# EAGLE design TaggerBits0.1 (EAGLE 7.3.0)
sdasdsadasdsads
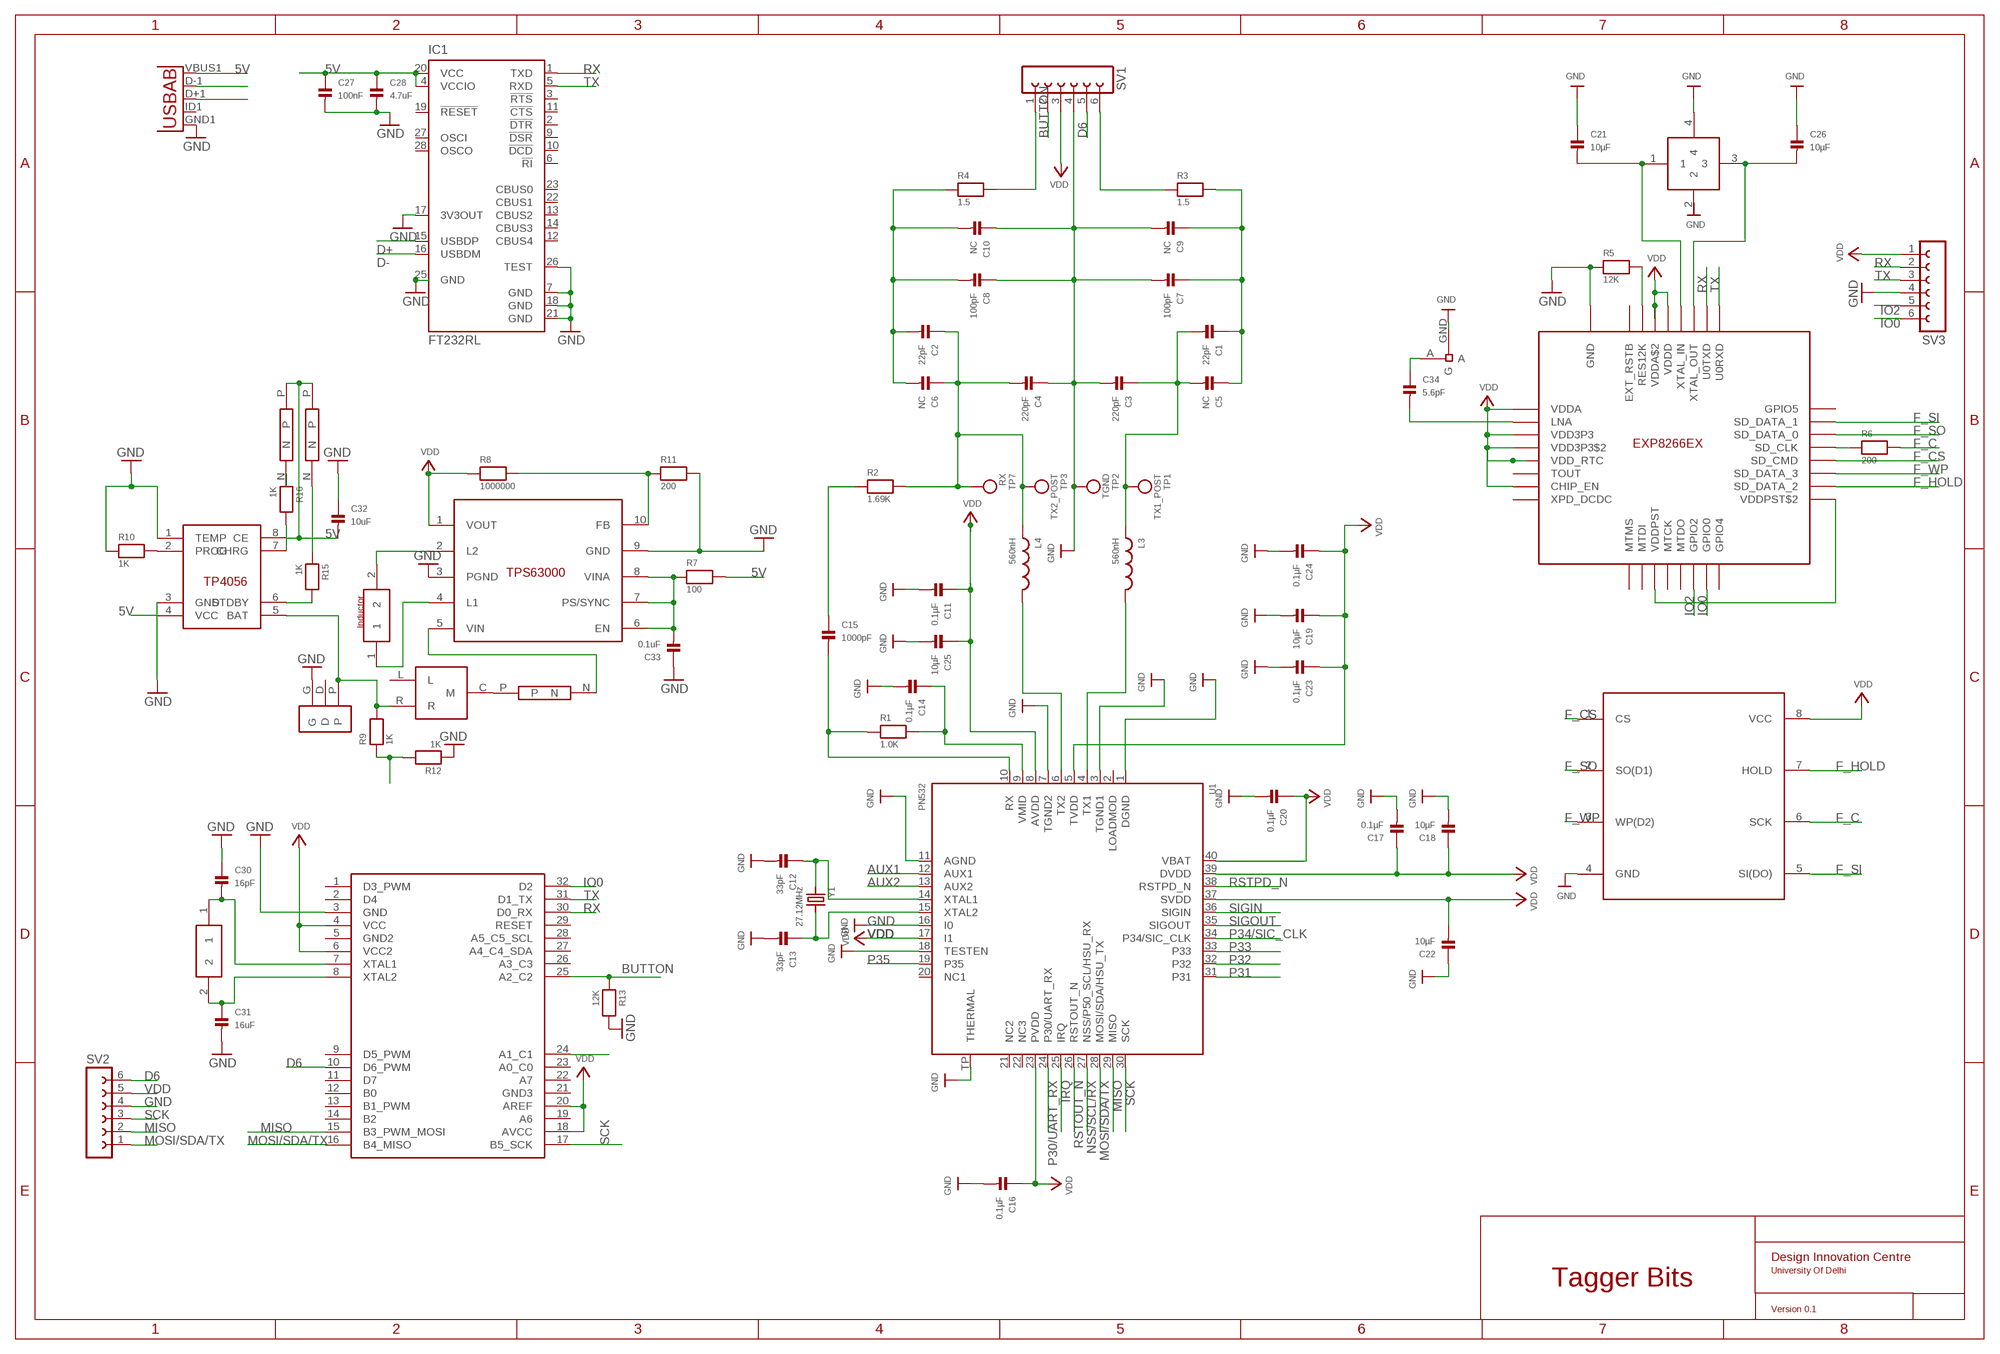
[diagram p0: schematic, sheet 1]

## Parts
C1  22pF  CAP_CERAMIC0805  [0805]
C2  22pF  CAP_CERAMIC0805  [0805]
C3  220pF  CAP_CERAMIC0805  [0805]
C4  220pF  CAP_CERAMIC0805  [0805]
C5  NC  CAP_CERAMIC0805  [0805]
C6  NC  CAP_CERAMIC0805  [0805]
C7  100pF  CAP_CERAMIC0805  [0805]
C8  100pF  CAP_CERAMIC0805  [0805]
C9  NC  CAP_CERAMIC0805  [0805]
C10  NC  CAP_CERAMIC0805  [0805]
C11  0.1µF  CAP_CERAMIC0805  [0805]
C12  33pF  CAP_CERAMIC0805  [0805]
C13  33pF  CAP_CERAMIC0805  [0805]
C14  0.1µF  CAP_CERAMIC0805  [0805]
C15  1000pF  CAP_CERAMIC0805  [0805]
C16  0.1µF  CAP_CERAMIC0805  [0805]
C17  0.1µF  CAP_CERAMIC0805  [0805]
C18  10µF  CAP_CERAMIC0805  [0805]
C19  10µF  CAP_CERAMIC0805  [0805]
C20  0.1µF  CAP_CERAMIC0805  [0805]
C21  10µF  CAP_CERAMIC0805  [0805]
C22  10µF  CAP_CERAMIC0805  [0805]
C23  0.1µF  CAP_CERAMIC0805  [0805]
C24  0.1µF  CAP_CERAMIC0805  [0805]
C25  10µF  CAP_CERAMIC0805  [0805]
C26  10µF  CAP_CERAMIC0805  [0805]
C27  100nF  CAP_CERAMIC0805  [0805]
C28  4.7uF  CAP_CERAMIC0805  [0805]
C30  16pF  CAP_CERAMIC0805  [0805]
C31  16uF  CAP_CERAMIC0805  [0805]
C32  10uF  CAP_CERAMIC0805  [0805]
C33  0.1uF  CAP_CERAMIC0805  [0805]
C34  5.6pF  CAP_CERAMIC0805  [0805]
GREEN  LED(805)  [LED(805)]
IC1  FT232RL  [SSOP28]
L3  560nH  INDUCTOR0805  [0805]
L4  560nH  INDUCTOR0805  [0805]
LED  LED(805)  [LED(805)]
R1  1.0K  RESISTOR0805  [0805]
R2  1.69K  RESISTOR0805  [0805]
R3  1.5  RESISTOR0805  [0805]
R4  1.5  RESISTOR0805  [0805]
R5  12K  RESISTOR0805  [0805]
R6  200  RESISTOR0805  [0805]
R7  100  RESISTOR0805  [0805]
R8  1000000  RESISTOR0805  [0805]
R9  1K  RESISTOR0805  [0805]
R10  1K  RESISTOR0805  [0805]
R11  200  RESISTOR0805  [0805]
R12  1K  RESISTOR0805  [0805]
R13  12K  RESISTOR0805  [0805]
R15  1K  RESISTOR0805  [0805]
R16  1K  RESISTOR0805  [0805]
RED  LED(805)  [LED(805)]
SV1  FE06-1  [FE06]
SV2  FE06-1  [FE06]
SV3  FE06-1  [FE06]
TP1  TX1_POST  TESTPOINTPAD  [TESTPOINT_PAD_2MM]
TP2  TGND  TESTPOINTPAD  [TESTPOINT_PAD_2MM]
TP3  TX2_POST  TESTPOINTPAD  [TESTPOINT_PAD_2MM]
TP7  RX  TESTPOINTPAD  [TESTPOINT_PAD_2MM]
U1  PN532  [HVQFN40-6X6]
U3  USB""  [USB-MICRO-SMD]
U4  ESP8266EX  [ESP8266EX]
U$3  FLASH  [SO08]
U$6  ATMEGA328TQFP  [TQFP32-08]
U$31  ANTENNAE  [ANTENNAE]
U$33  26MHZ  [T120]
U$41  TP4056  [SO08]
U$42  CRYSTAL  [CRYSTAL]
U$44  TPS63000  [SON10]
U$47  SPDT  [SPDT]
U$48  BCON  [BCON]
U$49  INDUCTOR  [INDUCTOR]
Y1  27.12MHz  CRYSTALTHIN  [CRYSTAL_3.2X2.5]

## Nets
5V: C27.1 C28.1 C32.2 GREEN.P IC1.4(VCCIO) IC1.20(VCC) R7.2 RED.P U3.VBUS1(VBUS) U$41.4(VCC) U$41.8(CE)
AUX1: U1.12(AUX1)
AUX2: U1.13(AUX2)
BATTERYI: R9.1 R12.2 U$6.24(A1_C1)
BUTTON: R13.1 SV1.2 U$6.25(A2_C2)
D6: SV1.5 SV2.6 U$6.10(D6_PWM)
D+: IC1.15(USBDP) U3.D+1(D+)
D-: IC1.16(USBDM) U3.D-1(D-)
F_C: R6.2 U$3.6(SCK)
F_CS: U4.SD_CMD U$3.1(CS)
F_HOLD: U4.SD_DATA_2 U$3.7(HOLD)
F_SI: U4.SD_DATA_1 U$3.5(SI(DO))
F_SO: U4.SD_DATA_0 U$3.2(SO(D1))
F_WP: U4.SD_DATA_3 U$3.3(WP(D2))
GND: C3.2 C4.1 C7.2 C8.1 C9.2 C10.1 C11.2 C12.2 C13.2 C14.2 C16.2 C17.2 C18.2 C19.2 C20.2 C21.1 C22.1 C23.2 C24.2 C25.2 C26.1 C27.2 C28.2 C30.1 C31.2 C32.1 C33.1 IC1.7(GND) IC1.17(3V3OUT) IC1.18(GND) IC1.21(GND) IC1.25(GND) IC1.26(TEST) R5.1 R10.1 R11.2 R12.1 R13.2 SV1.4 SV2.4 SV3.4 TP2.P$1 U1.1(DGND) U1.3(TGND1) U1.7(TGND2) U1.11(AGND) U1.16(I0) U1.18(TESTEN) U1.TP(THERMAL) U3.GND1(GND) U4.GND U$3.4(GND) U$6.3(GND) U$31.GND(G) U$33.4 U$41.1(TEMP) U$41.3(GND) U$44.3(PGND) U$44.9(GND) U$48.G
IO0: SV3.6 U4.GPIO0 U$6.32(D2)
IO2: SV3.5 U4.GPIO2
IRQ: U1.25(IRQ)
MISO: SV2.2 U1.29(MISO) U$6.15(B3_PWM_MOSI)
MOSI/SDA/TX: SV2.1 U1.28(MOSI/SDA/HSU_TX) U$6.16(B4_MISO)
N$1: L3.2 U1.4(TX1)
N$2: L4.2 U1.6(TX2)
N$3: C1.2 C3.1 C5.2 L3.1 TP1.P$1
N$4: R3.1 SV1.6
N$5: R4.2 SV1.1
N$6: C34.2 U4.LNA
N$7: C12.1 U1.14(XTAL1) Y1.1
N$8: C13.1 U1.15(XTAL2) Y1.2
N$9: C15.1 R2.1
N$10: C14.1 R1.2 U1.9(VMID)
N$11: C15.2 R1.1 U1.10(RX)
N$12: C2.1 C4.2 C6.1 L4.1 R2.2 TP3.P$1 TP7.P$1
N$13: LED.N U$44.5(VIN)
N$14: C21.2 U4.XTAL_IN U$33.1
N$15: C30.2 U$6.7(XTAL1) U$42.1
N$16: C31.1 U$6.8(XTAL2) U$42.2
N$17: C33.2 R7.1 U$44.6(EN) U$44.7(PS/SYNC) U$44.8(VINA)
N$18: R8.2 R11.1 U$44.10(FB)
N$19: R5.2 U4.RES12K
N$20: R6.1 U4.SD_CLK
N$21: C26.2 U4.XTAL_OUT U$33.3
N$22: U4.VDDPST U4.VDDPST$2
N$23: R10.2 U$41.2(PROG)
N$24: R9.2 U$41.5(BAT) U$47.R U$48.P
N$25: LED.P U$47.C(M)
N$26: U$44.4(L1) U$49.1
N$27: U$44.2(L2) U$49.2
N$28: C34.1 U$31.A
N$31: R15.2 U$41.6(STDBY)
N$32: R16.2 U$41.7(CHRG)
N$33: GREEN.N R15.1
N$34: R16.1 RED.N
NSS/SCL/RX: U1.27(NSS/P50_SCL/HSU_RX)
P30/UART_RX: U1.24(P30/UART_RX)
P31: U1.31
P32: U1.32
P33: U1.33
P34/SIC_CLK: U1.34(P34/SIC_CLK)
P35: U1.19(P35)
RSTOUT_N: U1.26(RSTOUT_N)
RSTPD_N: U1.38(RSTPD_N)
RX: IC1.1(TXD) SV3.2 U4.U0TXD U$6.30(D0_RX)
SCK: SV2.3 U1.30(SCK) U$6.17(B5_SCK)
SIGIN: U1.36(SIGIN)
SIGOUT: U1.35(SIGOUT)
TX: IC1.5(RXD) SV3.3 U4.U0RXD U$6.31(D1_TX)
TX1_ANTENNA: C1.1 C5.1 C7.1 C9.1 R3.2
TX2_ANTENNA: C2.2 C6.2 C8.2 C10.2 R4.1
VDD: C11.1 C16.1 C17.1 C18.1 C19.1 C20.1 C22.2 C23.1 C24.1 C25.1 R8.1 SV1.3 SV2.5 SV3.1 U1.5(TVDD) U1.8(AVDD) U1.17(I1) U1.23(PVDD) U1.37(SVDD) U1.39(DVDD) U1.40(VBAT) U4.CHIP_EN U4.VDD3P3 U4.VDD3P3$2 U4.VDD_RTC U4.VDDA U4.VDDA$2 U4.VDDD U$3.8(VCC) U$6.4(VCC) U$6.6(VCC2) U$6.18(AVCC) U$6.20(AREF) U$44.1(VOUT)
Unconnected: IC1.2(!DTR) IC1.3(!RTS) IC1.6(!RI) IC1.9(!DSR) IC1.10(!DCD) IC1.11(!CTS) IC1.12(CBUS4) IC1.13(CBUS2) IC1.14(CBUS3) IC1.19(!RESET) IC1.22(CBUS1) IC1.23(CBUS0) IC1.27(OSCI) IC1.28(OSCO) U1.2(LOADMOD) U1.20(NC1) U1.21(NC2) U1.22(NC3) U3.ID1(USBID) U4.EXT_RSTB U4.GPIO4 U4.GPOIO5(GPIO5) U4.MTCK U4.MTDI U4.MTDO U4.MTMS U4.TOUT U4.XPD_DCDC U$6.1(D3_PWM) U$6.2(D4) U$6.5(GND2) U$6.9(D5_PWM) U$6.11(D7) U$6.12(B0) U$6.13(B1_PWM) U$6.14(B2) U$6.19(A6) U$6.21(GND3) U$6.22(A7) U$6.23(A0_C0) U$6.26(A3_C3) U$6.27(A4_C4_SDA) U$6.28(A5_C5_SCL) U$6.29(RESET) U$33.2 U$47.L U$48.D

## Library data of the parts
C1-C28 C30-C34 = microbuilder:CAP_CERAMIC: Ceramic Capacitors 0402 - 0402 Surface Mount Capacitors 16pF 50V 5% [Digikey: 445-4899-2-ND] 18pF 50V 5% [Digikey: 490-1281-2-ND] 22pF 50V 5% [Digikey: 490-1283-2-ND] 68pF 50V 5% [Digikey: 490-1289-2-ND] 0.1uF 10V 10% [Digikey: 490-1318-2-ND] 1.0uF 6.3V 10% [Digikey: 490-1320-2-ND] 0603 - 0603 Surface Mount Capacitors 16 pF 50V 5% [Digikey: 445-5051-2-ND] 22 pF 50V [Digikey: PCC220ACVTR-ND] 33 pF 50V 5% [Digikey: 490-1415-1-ND] 56pF 50V 5% [Digikey: 490-1421-1-ND] 220pF 50V 5% [Digikey: 445-1285-1-ND] 680 pF 50V 2200 pF 50V 5% C0G [Digikey: 445-1297-1-ND] 5600 pF 100V 5% X7R [Digikey: 478-3711-1-ND] 0.1 µF 25V 10% [Digikey: PCC2277TR-ND] 0.22 µF 16V 10% X7R [Digikey: 445-1318-1-ND] 1.0 µF 25V 10% [Digikey: 445-5146-2-ND] 0603 - RF Specific 3pF 250V +/-0.1pF RF [Digikey: 712-1347-1-ND] 18 pF 250V 5% [Digikey: 478-3505-1-ND or 712-1322-1-ND] 56 pF 250V 5% C0G RF [Digikey: 490-4867-1-ND] 68 pF 250V RF [Digikey: 490-4868-1-ND] 0805 - 0805 Surface Mount Capacitors 220 pF 250V 2% RF Ceramic Capacitor [Digikey: 712-1398-1-ND] 1000 pF 50V 2% NP0 Ceramic Capacitor [Digikey: 478-3760-1-ND] 0.1 µF 25V 10% Ceramic Capacitor [Digikey: PCC1828TR-ND] 1.0 µF 16V 10% Ceramic Capacitor[Digikey: 490-1691-2-ND] 10.0 µF 10V 10% Ceramic Capacitor[Digikey: 709-1228-1-ND] 10.0 uF 16V 10% Ceramic Capacitor [Digikey: 478-5165-2-ND] 47 uF 6.3V 20% Ceramic Capacitor [Digikey: 399-5506-1-ND] 1206 - 1206 Surface Mount Capacitors 47uF 10V 20% Ceramic Capacitor [Digikey: 399-5508-1-ND]
GREEN LED RED = Tarun:LED(805)
IC1 = ftdichip:FT232R: Source: http://www.ftdichip.com/Documents/DataSheets/DS_FT232R_v104.pdf; MPN: FT232RL; OC_FARNELL: 1146032; OC_NEWARK: 91K9918
L3 L4 = microbuilder:INDUCTOR: Inductors 0603: 10nH Ceramic Inductor - microwire antenna/RF (Digikey: 712-1434-2-ND) 0805: 560nH Ceramic Inductor - RF (Digikey: 553-1047-1-ND) 1007 (2518 Metric) SMT: 10µH 10% 250mOhm 820mA 1007 Inductor (Digikey: 587-2189-1-ND) 22µH 10% 500mOhm 580mA 1007 Inductor (Digikey: 587-2190-1-ND) 47µH 10% 950mOhm 420mA 1007 Inductor (Digikey: 587-2191-1-ND) 47µH 5% 100mOhm 1A 1008 Inductor (Digikey: 732-1816-1-ND)
R1-R13 R15 R16 = microbuilder:RESISTOR: Resistors 0402 - 0402 Surface Mount Package 22 Ohm 1% 1/16W [Digikey: 311-22.0LRTR-ND] 33 Ohm 5% 1/16W 1.0K 5% 1/16W 1.5K 5% 1/16W 2.0K 1% 1/16W 10.0K 1% 1/16W [Digikey: 311-10.0KLRTR-ND] 10.0K 5% 1/16W [Digikey: RMCF0402JT10K0TR-ND] 12.1K 1% 1/16W [Digikey: 311-22.0LRTR-ND] 100.0K 5% 1/16W 0603 - 0603 Surface Mount Package 0 Ohm 1/10 Watt 1% Resistor 15 Ohm 1/10 Watt 1% Resistor 33 Ohm 1/10 Watt 1% Resistor 49.9 Ohm 1/10 Watt 1% Resistor 100 Ohm 1/10 Watt 1% Resistor 150 Ohm 1/10 Watt 1% Resistor 240 Ohm 1/10 Watt 1% Resistor 390 Ohm 1/10 Watt 1% Resistor 560 Ohm 1/10 Watt 1% Resistor 680 Ohm 1/10 Watt 1% Resistor 750 Ohm 1/10 Watt 1% Resistor 1.0K Ohm 1/10 Watt 1% Resistor 1.5K Ohm 1/10 Watt 1% Resistor 2.0K Ohm 1/10 Watt 1% Resistor 2.2K Ohm 1/10 Watt 1% Resistor 3.3K Ohm 1/10 Watt 1% Resistor 4.7K Ohm 1/10 Watt 1% Resistor 10.0K Ohm 1/10 Watt 1% Resistor 12.0K Ohm 1/10 Watt 1% Resistor 12.1K Ohm 1/10 Watt 1% Resistor 20.0K Ohm 1/10 Watt 1% Resistor 33.0K Ohm 1/10 Watt 1% Resistor 100.0K Ohm 1/10 Watt 1% Resistor 0805 - 0805 Surface Mount Package 0 Ohm 1/8 Watt 1% Resistor 33 Ohm 1/8 Watt 1% Resistor 100 Ohm 1/8 Watt 1% Resistor 150 Ohm 1/8 Watt 1% Resistor 200 Ohm 1/8 Watt 1% Resistor 240 Ohm 1/8 Watt 1% Resistor 330 Ohm 1/8 Watt 1% Resistor 390 Ohm 1/8 Watt 1% Resistor 470 Ohm 1/8 Watt 1% Resistor 1.0K Ohm 1/8 Watt 1% Resistor 1.5K Ohm 1/8 Watt 1% Resistor 2.0K Ohm 1/8 Watt 1% Resistor 4.7K Ohm 1/8 Watt 1% Resistor 5.1K Ohm 1/8 Watt 1% Resistor 5.6K Ohm 1/8 Watt 1% Resistor 10.0K Ohm 1/8 Watt 1% Resistor 22.0K Ohm 1/8 Watt 1% Resistor 33.0K Ohm 1/8 Watt 1% Resistor 100K Ohm 1/8 Watt 1% Resistor 1206 - 1206 Surface Mount Package
SV1-SV3 = con-lsta:FE06-1: FEMALE HEADER; OC_FARNELL: unknown; OC_NEWARK: unknown
TP1-TP3 TP7 = microbuilder:TESTPOINT: Test Point TESTPOINT_SMT - Compact Surface Mount Test Point [Digikey: 5016KTR-ND] TESTPOINT_PAD - Square Pad (2mm) TESTPOINT_SMT - Round Pad (2mm) TESTPOINT_0.1" - 0.1" Header
U1 = microbuilder:PN532: PN532 - Near Field Communication (NFC) controller Highly integrated transceiver module for contactless communication at 13.56 MHz (14443A/MIFARE, FeliCa, I4443B)
U3 = MicroUSB:USB: This is a USB AB connector that is compatible with USB OTG. i.e. this connector can serve as a host or device
U4 = ESP8266EX:ESP8266EX
U$3 = motorola-sensor-driver:FLASH
U$6 = atmel:ATMEGA328
U$31 = Tarun:ANTENNAE
U$33 = crystals:26MHZ
U$41 = motorola-sensor-driver:TP4056
U$42 = Tarun:CRYSTAL
U$44 = Tarun:TPS63000
U$47 = Tarun:SPDT
U$48 = Tarun:BCON
U$49 = Tarun:INDUCTOR
Y1 = microbuilder:CRYSTAL: Crystals HC49UP - Surface Mount Crystal 4.0MHz 18pF +/-30ppm Surface Mount Crystal [Digikey: 535-9857-1-ND] 12.0 MHz Surface Mount Crystal [Digikey: 535-9869-6-ND] 25.0 MHz Surface Mount Crystal [Digikey: 535-9078-1-ND] 3.2 x 2.5mm - MEMs SMT Crystal 12.0 MHz 8pF 15ppm 3.2 x 2.5mm Crystal [Digikey: -10-70°C: 644-1047-1-ND -40-125°C: 644-1128-1-ND] 16.0 MHz 8pF 15ppm 3.2 x 2.5mm Crystal [Digikey: -10-70°C: 644-1049-1-ND -40-125°C: 644-1129-2-ND] 16.0 MHz 10pF 10ppm 3.2 x 2.5mm Crystal [Digikey: 644-1100-1-ND] 27.12 MHz 18pF 30ppm 3.2 x 2.5mm Crystal [Digikey: 887-1424-1-ND] 27.12MHz 10pF 10ppm 3.2 x 2.5mm Crystal [Digikey: 887-1329-1-ND] 4.9 x 1.8mm - MEMs SMT Crystal 32.768 KHz 12.5pF 20ppm 4.9 x 1.8mm Crystal [Digikey: SE2415CT-ND] Cylinder 32.768KHz Cylinder Crystal

## Board
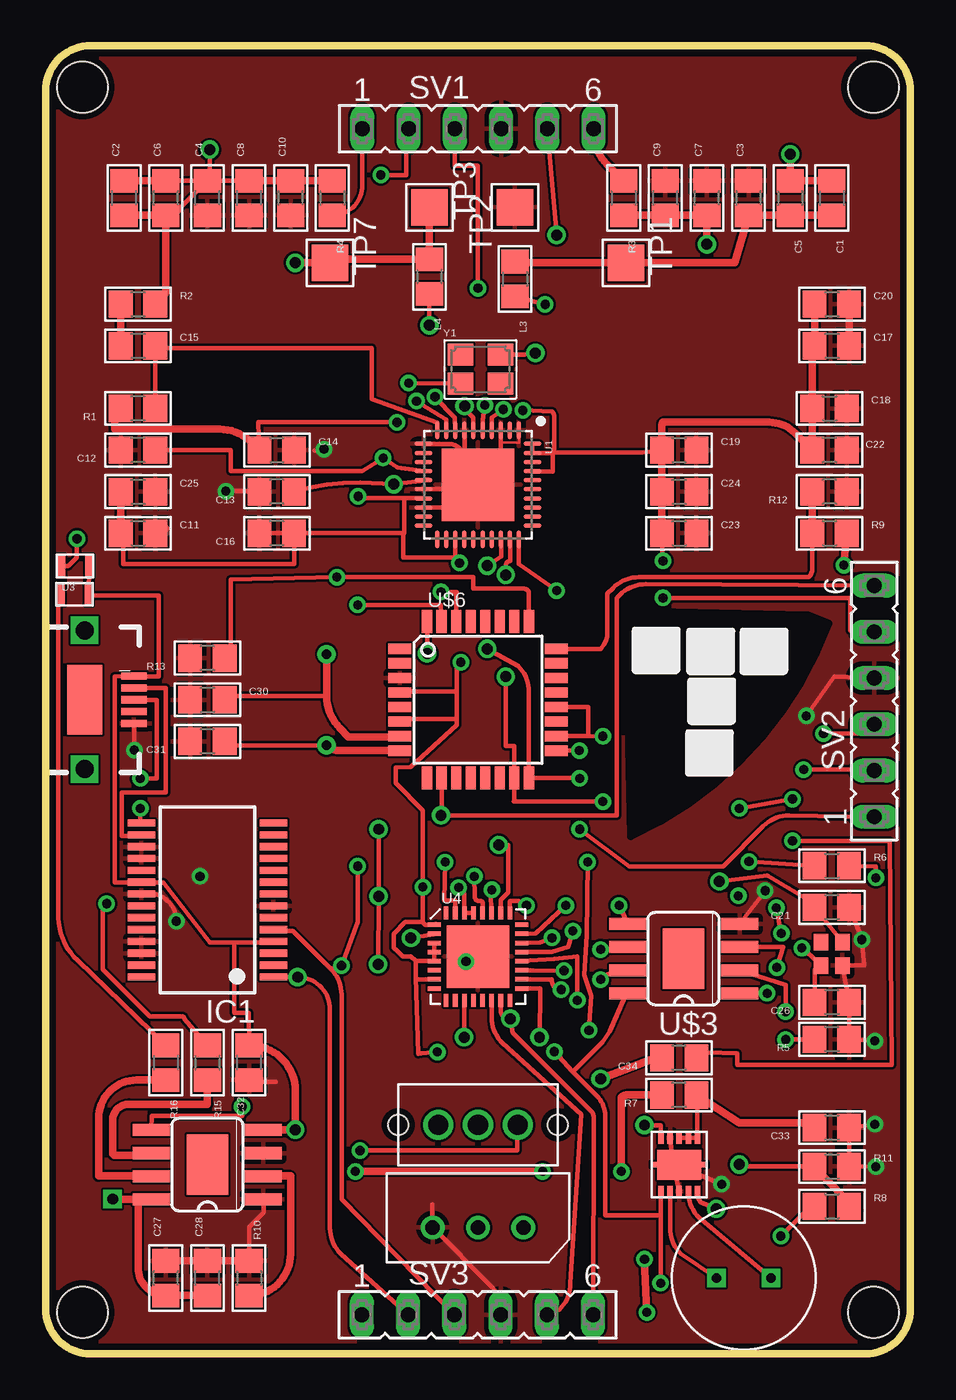
[diagram p1: board, top side]
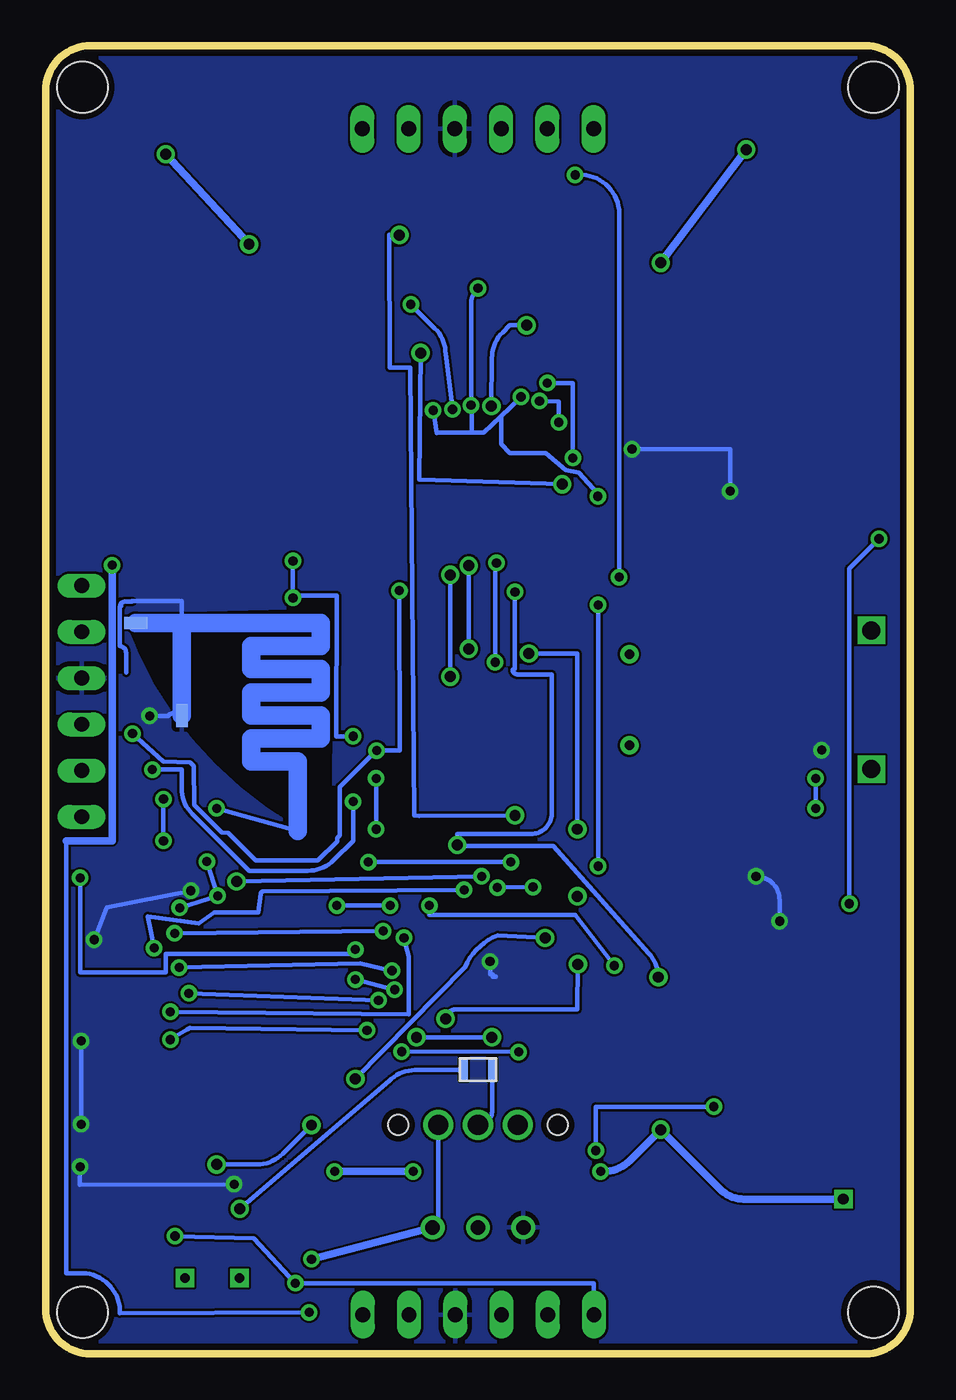
[diagram p2: board, bottom side, seen from below]

Size 47.5 x 71.88 mm. Coordinates in mm from the lower left corner, seen from the top.
Outline: 0,69.38 0,2.5 arc90 2.5,0 45,0 arc90 47.5,2.5 47.5,69.38 arc90 45,71.88 2.5,71.88 arc90 0,69.38
Copper layers (1*16): Top 0.035mm / dielectric 1.5mm / Bottom 0.035mm
Design rules "default *": minimum track width 5mil, minimum drill 10mil, track to track 5mil, track to pad 5mil, pad to pad 5mil, via to via 5mil, smd to smd 0mil, copper to edge 14mil, drill to drill 14mil, minimum pad ring 10mil, minimum via ring 8mil, stop-mask expansion 4mil, vias tented up to drill 0mil, thermal gap 10mil
Holes 2.8 mm at 2.03,69.6 45.47,69.6 45.47,2.29 2.03,2.29
tRestrict: area 31.9,28.4 to 43,40.8
bRestrict: area 31.9,28.3 to 43,40.8

### Footprints (pad centres in the part's own frame; a part is rotated, then mirrored left to right if it is on the bottom)
0805 = smd 1.3 x 1.5: 1 -0.95,0; 2 0.95,0
LED(805) = smd 0.45 x 1.25: N 0.775,0; P -0.775,0
SSOP28 = smd 0.4 x 1.5: 1 -4.225,-3.625; 2 -3.575,-3.625; 3 -2.925,-3.625; 4 -2.275,-3.625; 5 -1.625,-3.625; 6 -0.975,-3.625; 7 -0.325,-3.625; 8 0.325,-3.625; 9 0.975,-3.625; 10 1.625,-3.625; 11 2.275,-3.625; 12 2.925,-3.625; 13 3.575,-3.625; 14 4.225,-3.625; 15 4.225,3.625; 16 3.575,3.625; 17 2.925,3.625; 18 2.275,3.625; 19 1.625,3.625; 20 0.975,3.625; 21 0.325,3.625; 22 -0.325,3.625; 23 -0.975,3.625; 24 -1.625,3.625; 25 -2.275,3.625; 26 -2.925,3.625; 27 -3.575,3.625; 28 -4.225,3.625
FE06 = drill 0.813 long: 1 -6.35,0; 2 -3.81,0; 3 -1.27,0; 4 1.27,0; 5 3.81,0; 6 6.35,0
TESTPOINT_PAD_2MM = smd 2 x 2: P$1 0,0
HVQFN40-6X6 = smd 1 x 0.25: 1 -2.99,2.25; 2 -2.99,1.75; 3 -2.99,1.25; 4 -2.99,0.75; 5 -2.99,0.25; 6 -2.99,-0.25; 7 -2.99,-0.75; 8 -2.99,-1.25; 9 -2.99,-1.75; 10 -2.99,-2.25; 21 2.99,-2.25; 22 2.99,-1.75; 23 2.99,-1.25; 24 2.99,-0.75; 25 2.99,-0.25; 26 2.99,0.25; 27 2.99,0.75; 28 2.99,1.25; 29 2.99,1.75; 30 2.99,2.25 | smd 0.25 x 1: 11 -2.25,-2.99; 12 -1.75,-2.99; 13 -1.25,-2.99; 14 -0.75,-2.99; 15 -0.25,-2.99; 16 0.25,-2.99; 17 0.75,-2.99; 18 1.25,-2.99; 19 1.75,-2.99; 20 2.25,-2.99; 31 2.25,2.99; 32 1.75,2.99; 33 1.25,2.99; 34 0.75,2.99; 35 0.25,2.99; 36 -0.25,2.99; 37 -0.75,2.99; 38 -1.25,2.99; 39 -1.75,2.99; 40 -2.25,2.99 | smd 4 x 4: TP 0,0
USB-MICRO-SMD = smd 1.4 x 0.4: D+1 2.7,0; D-1 2.7,0.65; GND1 2.7,-1.3; ID1 2.7,-0.65; VBUS1 2.7,1.3 | drill 1 square: P$1 0,3.81; P$2 0,-3.81 | smd 1.93 x 3.81: P$3 0,0
ESP8266EX = smd 0.7 x 0.25: CHIP_EN -2.4,-1.25; GPOIO5 2.4,1.75; LNA -2.4,1.25; SD_CLK 2.4,0.25; SD_CMD 2.4,-0.25; SD_DATA_0 2.4,0.75; SD_DATA_1 2.4,1.25; SD_DATA_2 2.4,-1.25; SD_DATA_3 2.4,-0.75; TOUT -2.4,-0.75; VDD3P3 -2.4,0.75; VDD3P3$2 -2.4,0.25; VDD_RTC -2.4,-0.25; VDDA -2.4,1.75; VDDPST$2 2.4,-1.75; XPD_DCDC -2.4,-1.75 | smd 0.25 x 0.7: EXT_RSTB -1.75,2.4; GPIO0 1.25,-2.4; GPIO2 0.75,-2.4; GPIO4 1.75,-2.4; MTCK -0.25,-2.4; MTDI -1.25,-2.4; MTDO 0.25,-2.4; MTMS -1.75,-2.4; RES12K -1.25,2.4; U0RXD 1.75,2.4; U0TXD 1.25,2.4; VDDA$2 -0.75,2.4; VDDD -0.25,2.4; VDDPST -0.75,-2.4; XTAL_IN 0.25,2.4; XTAL_OUT 0.75,2.4 | smd 3.45 x 3.45: GND 0,0
SO08 = smd 0.66 x 2.032: 1 -1.905,-3.073; 2 -0.635,-3.073; 3 0.635,-3.073; 4 1.905,-3.073; 5 1.905,3.073; 6 0.635,3.073; 7 -0.635,3.073; 8 -1.905,3.073 | smd 3.327 x 2.286: P$1 0,0
TQFP32-08 = smd 1.27 x 0.559: 1 -4.293,2.8; 2 -4.293,2; 3 -4.293,1.2; 4 -4.293,0.4; 5 -4.293,-0.4; 6 -4.293,-1.2; 7 -4.293,-2; 8 -4.293,-2.8; 17 4.293,-2.8; 18 4.293,-2; 19 4.293,-1.2; 20 4.293,-0.4; 21 4.293,0.4; 22 4.293,1.2; 23 4.293,2; 24 4.293,2.8 | smd 0.559 x 1.27: 9 -2.8,-4.293; 10 -2,-4.293; 11 -1.2,-4.293; 12 -0.4,-4.293; 13 0.4,-4.293; 14 1.2,-4.293; 15 2,-4.293; 16 2.8,-4.293; 25 2.8,4.293; 26 2,4.293; 27 1.2,4.293; 28 0.4,4.293; 29 -0.4,4.293; 30 -1.2,4.293; 31 -2,4.293; 32 -2.8,4.293
ANTENNAE = smd 1.27 x 0.635: A -6.35,0 | smd 0.635 x 1.27: GND -3.81,-5.08
T120 = smd 0.899 x 0.798: 1 -0.648,0.584; 2 -0.648,-0.584; 3 0.648,-0.584; 4 0.648,0.584
CRYSTAL = drill 0.5: 1 -2.5,0; 2 2.5,0
SON10 = smd 0.3 x 0.65: 1 -1,-1.475; 2 -0.5,-1.475; 3 0,-1.475; 4 0.5,-1.475; 5 1,-1.475; 6 1,1.475; 7 0.5,1.472; 8 0,1.472; 9 -0.5,1.472; 10 -1,1.472 | smd 0.61 x 0.305: P$1 1.27,0; P$2 -1.27,0 | smd 2.4 x 1.65: PAD 0,0
SPDT = drill 1.1: C 0,0; L -2.191,0; R 2.191,0 | hole 1.1: -4.381,0; 4.381,0
BCON = drill 0.8: D 0,0.533; G 2.489,0.533; P -2.489,0.533
INDUCTOR = drill 0.508 square: 1 -1.499,0; 2 1.499,0
CRYSTAL_3.2X2.5 = smd 1.4 x 1.2: 1 -1.1,-0.8; 2 1.1,0.8; GND1 -1.1,0.8; GND2 1.1,-0.8

### Placement (x,y rotation side)
C1  43.18,63.5 270 top
C2  4.32,63.5 90 top
C3  38.61,63.5 90 top
C4  8.89,63.5 90 top
C5  40.89,63.5 270 top
C6  6.6,63.5 90 top
C7  36.32,63.5 90 top
C8  11.18,63.5 90 top
C9  34.04,63.5 90 top
C10  13.46,63.5 90 top
C11  5.08,45.09 0 top
C12  5.08,49.66 180 top
C13  12.7,47.37 180 top
C14  12.7,49.66 0 top
C15  5.08,55.38 0 top
C16  12.7,45.09 180 top
C17  43.18,55.38 0 top
C18  43.05,51.94 0 top
C19  34.8,49.66 0 top
C20  43.18,57.67 0 top
C21  43.18,24.54 180 top
C22  43.05,49.66 180 top
C23  34.8,45.09 0 top
C24  34.8,47.37 0 top
C25  5.08,47.37 0 top
C26  43.18,19.32 180 top
C27  6.6,4.17 90 top
C28  8.89,4.17 90 top
C30  8.89,35.94 0 top
C31  8.89,33.66 180 top
C32  11.18,16 90 top
C33  43.18,12.43 180 top
C34  34.8,16.27 180 top
GREEN  1.63,43.28 180 top
IC1  8.89,24.94 90 top
L3  25.78,59.05 270 top
L4  21.08,59.18 270 top
LED  23.75,15.62 180 bottom
R1  5.08,51.94 180 top
R2  5.08,57.67 0 top
R3  31.75,63.5 270 top
R4  15.75,63.5 270 top
R5  43.18,17.28 180 top
R6  43.18,26.82 0 top
R7  34.8,14.22 180 top
R8  43.18,8.12 0 top
R9  43.05,45.09 0 top
R10  11.18,4.17 270 top
R11  43.18,10.3 0 top
R12  43.05,47.37 180 top
R13  8.89,38.23 180 top
R15  8.89,16 270 top
R16  6.6,16 270 top
RED  1.6,41.73 180 top
SV1  23.75,67.31 0 top
SV2  45.52,35.86 90 top
SV3  23.72,2.16 0 top
TP1  31.88,59.94 270 top
TP2  25.78,62.99 90 top
TP3  21.08,62.99 270 top
TP7  15.62,59.94 270 top
U1  23.75,47.75 270 top
U3  2.15,35.94 0 top
U4  23.75,21.83 0 top
U$3  35.04,21.72 90 top
U$6  23.75,35.94 0 top
U$31  36.2,40.16 0 bottom
U$33  43.18,21.98 270 top
U$41  8.89,10.4 90 top
U$42  15.43,35.94 270 top
U$44  34.8,10.4 0 top
U$47  23.75,12.59 0 top
U$48  23.75,7.48 180 top
U$49  38.34,4.18 180 top
Y1  23.88,54.1 0 top

### Tracks (layer width: path | path; a pad name or v marks a point on that pad's centre or on a via)
5V  (via drill 0.5, 0.6)
  Top 0.254: GREEN.P RED.P 2.32,41.66 6.22,41.66 6.22,37.21 5.11,37.21 arc-90 U3.VBUS1 3.81,37.21 3.81,25.91 arc-45 3.83,25.92 IC1.20 arc45 5.29,25.91 6.48,25.91 9.02,22.61 10.36,22.61 | IC1.4 arc-45 12.37,22.61 10.36,22.61 | C32.2 11.15,18.75 10.36,18.75 10.36,22.61 | U$41.8 5.8,8.51 4.24,8.51
  Top 0.406: C28.1 C27.1 arc-90 5.08,4.74 5.08,8.38 | 5.08,8.51 5.08,8.38 | 5.08,8.38 arc90 4.95,8.51 4.24,8.51 v3.68,8.51 | U$41.4 arc-45 11.99,12.32 v13.72,12.32 13.72,14.45 arc90 11.22,16.95 C32.2 | R7.2 31.93,14.22 arc45 31.62,14.1 v31.62,10.03 | v27.3,10.03 v17.02,10.03
  Bottom 0.406: v3.68,8.51 9.14,8.51 arc45 10.45,9.05 v13.72,12.32 15.42,10.62 arc45 16.83,10.03 v17.02,10.03 | v31.62,10.03 v27.3,10.03
BATTERYI
  Top 0.254: U$6.24 arc45 28.06,38.73 30.48,38.73 arc45 30.86,39.66 30.86,41.78 31.16,42.09 arc-45 32.58,42.67 41.91,42.67 arc45 42.1,43.14 R9.1
  Top 0.406: R9.1 R12.2
BUTTON  (via drill 0.5)
  Top 0.254: U$6.25 26.55,41.78 arc90 26.54,41.78 arc90 26.29,42.04 23.5,42.04 23.5,42.67 v16,42.67 10.16,42.55 10.16,38.55 arc-90 R13.1 | SV1.2 arc90 19.81,67.18 19.81,64.77 v18.41,64.77
  Bottom 0.254: v18.41,64.77 arc90 16,62.87 v16,42.67
D6  (via drill 0.6)
  Top 0.254: SV1.5 v28.07,61.47 | U$6.10 21.75,29.67 arc-45 v21.72,29.59 arc-45 22.02,29.59 31.37,29.59 31.37,41.53 31.55,41.7 arc-45 32.96,42.29 SV2.6
  Bottom 0.254: v21.72,29.59 arc-90 21.84,29.59 26.98,29.54 27.25,29.59 27.46,54.18 28.6,54.18 28.63,61.49 v28.07,61.47
D+  (via drill 0.5)
  Top 0.254: U3.D+1 6.1,35.94 6.1,31.62 v5.21,31.62 | v5.21,29.97 5.21,29.31 arc45 IC1.15
  Bottom 0.254: v5.21,31.62 v5.21,29.97
D-
  Top 0.254: U3.D-1 6.57,36.59 arc-45 6.6,36.58 6.6,30.86 4.19,30.86 4.19,28.45 5.1,28.45 arc45 IC1.16
F_C  (via drill 0.5)
  Top 0.254: R6.2 45.59,26.8 v45.59,26.16 | U$3.6 v30.48,22.23
  Bottom 0.254: v30.48,22.23 30.35,21.97 40.89,21.97 40.89,20.95 45.59,20.95 v45.59,26.16
F_CS  (via drill 0.5)
  Top 0.254: U4.SD_CMD 27.94,21.72 29.21,21.84 v29.21,19.43 | v39.62,19.81 U$3.1
  Bottom 0.254: v29.21,19.43 v39.62,19.81
F_HOLD  (via drill 0.5)
  Top 0.254: U$3.7 31.71,21.08 arc45 v30.48,20.57 | U4.SD_DATA_2 arc90 U4.SD_DATA_2 27.81,20.57 27.81,20.45 arc90 v28.32,20.02
  Bottom 0.254: v30.48,20.57 v28.32,20.02
F_SI  (via drill 0.5)
  Top 0.254: v31.5,24.64 U$3.5 | U4.SD_DATA_1 26.92,23.11 v28.57,24.64
  Bottom 0.254: v28.57,24.64 v31.5,24.64
F_SO  (via drill 0.5)
  Top 0.254: 38.23,21.08 U$3.2 40.64,20.27 v40.64,18.8 | U4.SD_DATA_0 27.18,22.61 v27.81,22.86
  Bottom 0.254: v40.64,18.8 27.56,18.67 27.56,21.84 v27.81,22.86
F_WP  (via drill 0.5)
  Top 0.254: U$3.3 40.51,22.35 v40.16,21.23 | v28.47,21.06 26.8,21.08 U4.SD_DATA_3
  Bottom 0.254: v28.47,21.06 30.23,21.46 v40.16,21.23
GND  (via drill 0.5, 0.5 pad 0.25)
  Top 0.127: U1.1 26.01,50.06 25,50.06 25,50.09
  Top 0.254: SV3.4 25.02,2.36 arc45 24.43,3.77 U$48.G 21.23,6.97 21.23,8.23 | 12.06,8.51 arc-90 12.05,8.5 U$41.1 11.99,8.47 11.99,7.77 11.2,6.99 11.2,5.14 R10.1 | SV2.4 43.31,37.21 v41.78,35.05 | U$3.4 v39.52,25.45 | 44.91,22.68 44.72,23.12 C21.1 | v44.83,22.76 44.96,21.34 U$33.4 C26.1 R5.1 v45.54,17.2 | v45.54,12.62 C33.1 R11.2 v45.59,10.29 | U$44.9 34.44,10.52 34.58,9.92 | 34.58,9.92 U$44.3 | v37.13,9.32 35.71,9.93 34.58,9.92 | U1.7 23.01,50.74 23.01,49.12 | 23.01,49.12 23.01,49.05 | 23.01,49.05 25,49.05 25,50.09 U1.3 | U1.16 22.76,47.5 22.76,47.52 23.01,47.52 | 23.01,47.52 23.75,47.52 U1.TP 23.75,46.5 U1.18 | C16.2 13.66,45.09 | C32.1 11.27,14.96 12.65,14.96 | U3.GND1 4.88,34.61 v4.88,33.17 | U4.GND 23.75,21.57 v23.09,21.57 | C13.2 11.75,47.4 v9.91,47.4 | v15.29,49.71 15.29,49.63 14.76,49.63 | U1.11 20.76,49.99 22.15,49.99 arc-90 23.01,49.12 | 23.01,49.05 23.01,48.92 arc-90 22.96,48.87 22.96,47.57 arc90 23.01,47.52 | IC1.21 IC1.21 arc-90 5.28,25.3 5.66,25.3 arc-90 v7.19,23.77 | v8.48,26.24 8.48,26.34 arc90 8.36,26.47
  Top 0.406: C11.2 6.6,45.34 | C27.2 C28.2 R10.1 | C25.2 6.15,47.49 arc-45 6.48,47.62 | C20.2 C17.2
  Bottom 0.254: U$31.GND arc-90 40.77,35.05 v41.78,35.05 | v39.52,25.45 C21.1 v44.83,22.76 | v45.54,17.2 v45.54,12.62 | v45.59,10.29 45.62,9.3 v37.13,9.32 | v4.88,33.17 4.88,33.35 | v23.09,21.57 23.09,20.85 22.94,20.85 22.94,20.73 22.78,20.73 22.78,20.75 22.86,20.75 | 40.01,40.16 40.01,41.38 42.77,41.38 | v9.91,47.4 9.91,49.71 v15.29,49.71 | v7.19,23.77 7.19,24.94 arc-90 v8.48,26.24
  pour Bottom: 0.64,69.44 arc-90 2.51,71.32 45.69,71.32 arc-90 47.12,69.9 47.12,1.7 arc-90 45.69,0.28 2.67,0.28 arc-90 0.58,2.36 0.58,69.47
  pour Top: 0.46,69.34 arc-90 2.39,71.27 46.23,71.27 arc-90 47.19,70.31 47.19,2.06 arc-90 45.49,0.36 2.95,0.36 arc-90 0.51,2.79
IO0  (via drill 0.6)
  Top 0.254: U$6.32 arc-90 U$6.32 v20.95,38.48 | v18.29,28.83 v18.29,25.15 v18.26,21.41 | U4.GPIO0 25,18.82 arc90 v25.53,18.41 25.65,17.65 29.97,13.34 arc-45 30.1,13.03 SV3.6
  Bottom 0.254: v18.26,21.41 18.29,18.92 24.89,18.92 arc-90 v25.53,18.41 | v18.29,28.83 18.29,38.48 v20.95,38.48
IO2
  Top 0.254: SV3.5 28.24,2.46 arc45 28.83,3.88 29.41,13.16 25.09,17.08 arc-45 24.5,18.49 U4.GPIO2
MISO  (via drill 0.5, 0.6)
  Top 0.254: v30.61,30.35 25.78,30.35 | 25.78,30.35 25.71,30.35 | 25.78,30.35 arc-45 25.75,30.43 U$6.15 25.75,33.37 arc90 25.72,33.4 25.27,33.4 v25.27,37.21 | v25.27,42.8 25.27,43.31 arc-90 25.53,43.56 25.53,44.73 arc90 U1.29 | SV2.2 arc-45 45.91,32.11 v41.63,32.11
  Bottom 0.254: v30.61,30.35 arc45 30.61,30.3 30.61,28.19 31.67,27.13 arc45 33.09,26.54 36.32,26.54 39.45,29.67 arc45 40.03,31.08 40.03,32.11 v41.63,32.11 | v25.27,42.8 v25.27,37.21
MOSI/SDA/TX  (via drill 0.5, 0.6)
  Top 0.254: U1.28 arc-45 25.02,44.71 25.02,43.81 v24.26,43.31 | v24.26,38.73 25.96,37.79 arc-45 26.55,36.38 U$6.16 29.28,31.65 arc-45 v29.34,31.62 | SV2.1 40.83,29.59 arc45 39.42,29 37.21,26.8 32.06,26.8 v29.34,28.83
  Bottom 0.254: v24.26,43.31 v24.26,38.73 | v29.34,31.62 v29.34,28.83
N$1  (via drill 0.5)
  Top 0.254: L3.2 v27.43,57.66 | U1.4 arc45 24.51,50.77 24.51,51.44 v25.15,51.89
  Bottom 0.254: v27.43,57.66 26.11,56.34 arc45 25.53,54.92 v25.15,51.89
N$2  (via drill 0.6)
  Top 0.254: 22.99,52.07 arc-90 v23.01,52.07 arc45 23.08,51.85 23.5,51.44 23.5,50.75 arc45 U1.6 | v21.08,56.52 L4.2
  Bottom 0.254: v21.08,56.52 22,56.52 22.4,56.12 arc-45 22.99,54.7 v23.01,52.07
N$3
  Top 0.406: TP1.P$1 37.85,59.94 C3.1 C5.2 C1.2 | TP1.P$1 31.88,59.82 | L3.1 arc45 26.23,59.94 TP1.P$1
N$4
  Top 0.406: R3.1 30.83,65.37 arc-45 30.1,67.14 SV1.6
N$5
  Top 0.254: SV1.1 17.4,64.2 arc-90 R4.2
N$6  (via drill 0.6)
  Top 0.254: v20.07,22.86 21.3,23.04 U4.LNA
  Top 0.406: C34.2 arc-90 33.78,16.34 33.78,16.38 v30.48,15.11
  Bottom 0.254: v30.48,15.11 24.46,21.26 arc45 22.67,22.99 v20.07,22.86
N$7  (via drill 0.5)
  Top 0.254: Y1.1 v19.94,53.34 | U1.14 19.33,48.69 v18.54,49.23 17.4,48.51 10.16,48.51 10.16,49.66 C12.1
  Bottom 0.254: v19.94,53.34 18.54,53.34 v18.54,49.23
N$8  (via drill 0.6)
  Top 0.254: U1.15 arc-45 21.1,48.01 v19.13,47.78 17.27,47.88 arc16 C13.1 | Y1.2 26.33,54.9 v26.9,54.99
  Bottom 0.254: v19.13,47.78 26.98,48.03 v26.9,54.99
N$9
  Top 0.406: C15.1 R2.1
N$10  (via drill 0.5)
  Top 0.254: C14.1 11.68,51.18 v19.3,51.18 | v20.37,52.35 22,51.33 U1.9
  Top 0.406: R1.2 3.81,51.56 | 3.81,51.56 3.68,51.94 | C14.1 11.34,50.07 arc45 9.57,50.8 3.81,50.8 3.81,51.56
  Bottom 0.254: v19.3,51.18 19.3,52.32 v20.37,52.35
N$11
  Top 0.254: R1.1 C15.2 arc45 6.37,55.24 17.91,55.24 17.91,52.45 21.51,51.16 U1.10
N$12  (via drill 0.6)
  Top 0.254: 9.02,64.58 v9.02,66.17 | C4.2 7.26,62.82
  Top 0.406: C6.1 C2.1 | C6.1 arc45 7.26,62.82 | R2.2 arc90 6.22,57.86 6.22,58.04 arc90 6.6,58.42 C6.1 | TP3.P$1 21.08,60.33 arc90 21.21,60.2 21.15,60.2 arc90 L4.1 15.81,60.13 arc90 TP7.P$1 v13.72,59.94 | C4.2 arc90 9.02,64.58
  Bottom 0.406: v13.72,59.94 v9.02,66.17
N$13  (via drill 0.6)
  Top 0.254: U$44.5 35.8,8.8 arc45 35.81,8.76 arc45 35.99,8.33 v36.83,7.98
  Bottom 0.254: v36.83,7.98 28.63,15.01 arc45 27.21,15.6 LED.N
N$14  (via drill 0.5, 0.6)
  Top 0.254: U$33.1 C21.2 arc90 41.75,25.02 39.62,26.29 v37.01,25.96 | U4.XTAL_IN arc-90 U4.XTAL_IN 24,24.76 arc-90 24,24.77 arc90 23.88,24.89 23.77,24.89 arc-90 23.57,25.12 v23.55,26.24
  Bottom 0.254: v23.55,26.24 v37.01,25.96
N$15
  Top 0.254: 15.43,36.15 10.05,36.15 arc90 C30.2
  Top 0.406: U$6.7 arc-45 19.38,33.91 16.64,33.91 16.16,34.38 arc-45 15.43,36.15 U$42.1
N$16
  Top 0.254: U$42.2 10.05,33.44 arc-90 C31.1
  Top 0.406: U$42.2 arc45 16.16,33.14 U$6.8
N$17
  Top 0.254: R7.1 arc90 35.88,14.1 36.2,14.1 arc90 35.8,13.7 U$44.6 | U$44.6 arc-90 U$44.6 U$44.7 | U$44.7 U$44.8 | U$44.7 U$44.6
  Top 0.406: C33.2 arc90 41.96,12.7 38.1,12.7 R7.1
N$18  (via drill 0.6)
  Top 0.254: R11.1 38.21,10.3 arc-90 v38.1,10.41 | v32.89,12.57 33.78,12.57 33.78,11.91 arc45 U$44.10
  Top 0.406: R8.2 44.23,8.02 arc45 44.58,7.87 42.29,10.16 arc-45 R11.1
  Bottom 0.254: v38.1,10.41 35.88,10.41 arc-45 34.47,11 v32.89,12.57
N$19  (via drill 0.5)
  Top 0.254: 29.72,26.67 arc-90 v29.77,27.03 29.72,22.99 29.59,20.83 29.97,19.68 v29.84,17.78 | v40.64,17.27 42.2,17.27 arc45 R5.2 | U4.RES12K arc90 U4.RES12K 22.5,24.92 21.89,24.92 v21.95,27.03
  Bottom 0.254: v21.95,27.03 v29.77,27.03 | v29.84,17.78 39.56,17.91 arc-45 39.7,17.83 v40.64,17.27
N$20  (via drill 0.5)
  Top 0.254: U4.SD_CLK 27.81,22.1 28.7,22.35 v28.96,23.24 | v38.63,27.05 R6.1 | v40.41,23.11 v40.13,24.51
  Bottom 0.254: v28.96,23.24 v40.41,23.11 | v38.63,27.05 v38.05,25.17 v40.13,24.51
N$21  (via drill 0.5)
  Top 0.254: C26.2 42.23,20.97 arc-90 U$33.3 41.77,22.11 arc45 v41.53,22.3 | U4.XTAL_OUT arc90 24.51,24.24 24.41,25.38 v24.51,25.5
  Bottom 0.254: v24.51,25.5 35.56,25.4 arc-90 35.69,25.27 35.81,24.26 38.23,24.26 39.09,23.65 41.89,24.03 v41.53,22.3
N$22  (via drill 0.6)
  Top 0.254: U4.VDDPST arc45 22.99,19.4 v22.99,17.4 | v27.13,17.4 27.18,20.07 arc90 27.16,20.08 U4.VDDPST$2
  Bottom 0.254: v22.99,17.4 v27.13,17.4
N$23
  Top 0.406: R10.2 arc90 13.46,5.5 13.46,9.78 11.98,9.78 arc90 U$41.2
N$24  (via drill 0.5)
  Top 0.254: U$47.R 25.91,11.18 v17.27,11.18 | v10.79,13.59 10.79,13.08 5.84,13.08 U$41.5
  Top 0.406: R9.2 v43.84,43.33 | v33.02,2.29 v32.89,5.21
  Bottom 0.254: U$47.R 25.94,7.25 arc90 U$48.P | v17.27,11.18 17.27,13.59 v10.79,13.59 | v33.02,2.29 43.41,2.23 arc-90 45.47,4.45 46.35,4.45 46.35,28.19
  Bottom 0.406: v43.84,43.33 43.84,28.19 46.35,28.19 | v32.89,5.21 U$48.P
N$25
  Bottom 0.254: LED.P 22.97,13.36 arc90 U$47.C
N$26
  Top 0.254: U$49.1 35.88,7.5 arc-45 35.3,8.91 U$44.4
N$27
  Top 0.254: U$49.2 34.88,5.5 arc-45 34.3,6.92 U$44.2
N$28  (via drill 0.5)
  Top 0.254: 35.43,16.58 37.97,16.51 37.97,15.88 46.48,15.88 46.35,28.19 v41.02,28.19 | v41.02,30.48 v38.1,29.97
  Top 0.406: C34.1 arc-90 35.43,16.58
  Bottom 0.254: v41.02,28.19 v41.02,30.48 | v38.1,29.97 33.66,28.73
N$29
  Bottom 0.254: 43.41,40.62 arc-90 43.43,40.59 | 43.43,40.59 43.43,38.89 arc90 43.08,38.53 43.08,37.44 | 43.33,41.1 arc-90 43.43,41 43.43,40.59
N$30
  Bottom 0.254: 43.41,41.07 arc90 43.16,41.33 42.75,41.33
N$31
  Top 0.406: U$41.6 arc-90 5.7,10.92 3.81,10.92 arc-90 3.68,11.05 3.68,12.83 arc-90 4.57,13.72 8.89,13.72 R15.2
N$32
  Top 0.406: U$41.7 arc90 5.8,9.78 2.92,9.78 2.92,12.95 arc-90 5.02,15.05 R16.2
N$33  (via drill 0.5 pad 0.25)
  Top 0.254: GREEN.N 1.25,43.28 1.73,43.76 v1.73,44.78 | R15.1 7.62,18.41 arc90 7.49,18.54 5.71,18.54 3.14,21.12 3.14,24.52 v3.35,24.74
  Bottom 0.254: v1.73,44.78 3.35,43.16 v3.35,24.74
N$34
  Top 0.254: R16.1 1.77,21.61 arc-45 0.7,23.97 0.7,41.6 RED.N
RX  (via drill 0.5, 0.6)
  Top 0.254: 25.02,24.3 arc-45 U4.U0TXD arc-45 24.99,24.24 24.99,24.94 25.38,25.33 arc45 25.4,25.38 25.4,27.96 v24.89,27.96 | IC1.1 13.8,20.72 arc-45 v13.84,20.7 arc-90 15.62,18.92 15.62,6.92 arc45 16.21,5.51 SV3.2 | v21.72,41.86 22.58,41.86 arc90 22.55,41.85 U$6.30
  Bottom 0.254: v24.89,27.96 arc45 24.94,27.91 | 24.94,27.91 19.61,27.91 14.38,22 arc45 v13.84,20.7 | 24.94,27.91 arc-45 24.87,28.09 24.89,28.57 20.95,28.57 arc-90 19.71,29.57 19.71,37.34 21.59,37.34 arc90 21.84,37.59 arc-90 21.72,37.72 v21.72,41.86
SCK  (via drill 0.5, 0.5 pad 0.25)
  Top 0.254: U1.30 25.98,43.38 v28.07,41.94 | v29.31,33.15 U$6.17 | v42.72,34.09 45.01,34.09 SV2.3
  Bottom 0.254: v28.07,41.94 U$6.17 v29.31,33.15 29.34,33.15 31.34,31.14 31.34,28.47 31.47,28.35 31.47,28.17 32.54,27.1 35.94,27.1 37.47,28.63 37.82,28.65 39.32,30.15 39.37,32.31 39.55,32.49 41.02,32.54 v42.72,34.09
TX  (via drill 0.5)
  Top 0.254: SV3.3 16.26,8.51 16.26,19.75 arc45 15.67,21.16 | 15.67,21.16 13.59,23.24 12.7,23.24 arc-45 IC1.5 | U4.U0RXD 25.5,24.82 arc-45 25.53,24.89 25.8,24.89 arc-45 v26.42,24.64 | 15.67,21.16 v16.26,21.34 17.14,23.75 v17.14,26.8 | U$6.31 21.72,41.15 v17.14,41.15
  Bottom 0.254: v26.42,24.64 26.42,24.13 18.41,24.13 v16.26,21.34 | v17.14,41.15 v17.14,26.8
TX1_ANTENNA  (via drill 0.6)
  Top 0.406: R3.2 C9.1 C7.1 v36.32,60.96 | v40.89,65.91 C5.1 C1.1
  Bottom 0.406: v36.32,60.96 v40.89,65.91
TX2_ANTENNA
  Top 0.254: C8.2 C6.2
  Top 0.406: C2.2 C6.2 | C8.2 C10.2 R4.1
VDD  (via drill 0.5, 0.5 pad 0.25)
  Top 0.254: U4.VDDD U4.VDDA$2 23,25.31 v22.68,25.63 | 21.45,23.62 arc45 U4.VDDA 20.84,23.58 20.7,23.72 | U4.VDD3P3 U4.VDD3P3$2 U4.VDD_RTC 20.85,21.58 20.32,21.59 | U4.CHIP_EN arc-45 21.33,20.57 20.32,20.57 20.32,20.73 | v33.78,3.89 U$44.1 33.78,8.76 33.78,7.62 30.73,7.62 30.73,13.08 arc45 30.29,14.16 28.96,15.49 | 41.91,8 v40.39,6.48 | SV2.5 44.2,39.75 44.2,41.53 v33.91,41.53 | v33.91,43.56 C23.1 | SV1.3 22.48,65.28 23.75,65.28 v23.75,58.55 | v24.13,52.12 24,51.31 U1.5 | U1.39 U1.40 | U1.39 27.84,49.51 | 27.84,49.51 32.77,49.53 C19.1 | U$6.18 28.85,33.94 29.87,33.94 | 20.32,21.59 20.32,20.73 | U$3.8 arc-90 31.84,19.68 30.99,17.73 30.61,17.14 28.96,15.49 | 20.83,21.59 20.32,21.59 | v27.94,16.61 28.96,15.49 | v21.51,16.59 20.62,16.51 20.47,16.48 20.32,20.73 | 29.87,33.94 v30.61,33.93 | v26.21,51.84 27.82,51.77 arc-45 27.94,51.47 27.94,49.75 arc-45 27.84,49.51 | U1.8 22.48,51.44 v21.39,52.58 | C11.1 4.27,45.09 4.27,43.41 13.65,43.41 C16.1 19.63,45.09 | 19.63,45.09 19.71,45.09 19.71,47.02 | 19.71,47.02 20.76,47.02 U1.17 | U1.23 22.5,43.76 | 22.5,43.76 19.63,43.76 19.63,45.09 | 19.71,47.02 17.17,47.02 v17.17,47.12 | 20.7,23.72 19.76,23.72 19.13,23.09 19.13,22.3 19.2,22.23 19.23,22.23 19.61,21.84 20.07,21.84 20.32,21.59 | 20.7,23.72 20.73,23.75 v20.73,25.65 20.73,29.87 19.23,31.37 19.23,32.23 20.07,32.26 22.58,34.54 22.58,34.87 | U$6.20 28.12,35.54 | 29.87,33.94 29.79,34.01 29.79,35.54 28.12,35.54 | 22.58,34.87 22.58,36.4 | 22.58,36.4 22.58,37.77 v22.81,38 | v22.73,43.46 22.5,43.46 22.5,43.76 | U$6.4 19.51,36.4 22.58,36.4 | U$6.6 19.59,34.87 22.58,34.87 | U1.39 27.86,49.5 27.86,48.46 26.74,48.46 U1.37 | 28.12,35.54 28.12,35.48
  Top 0.406: C11.1 C25.1 | C20.1 C17.1 arc45 42.1,55.08 C18.1 C22.2 41.16,50.59 arc45 39.75,51.18 33.91,51.18 arc45 33.85,51.03 C19.1 C24.1 33.83,47.35 arc45 33.78,47.24 arc-45 33.85,47.09 C23.1 | R8.1 arc-45 41.95,8 41.91,8
  Bottom 0.254: SV3.1 17.4,3.89 v33.78,3.89 36.07,6.35 v40.39,6.48 | v33.91,43.56 v33.91,41.53 arc45 33.6,41.66 31.5,41.66 31.52,33.93 v30.61,33.93 | v23.75,58.55 arc-45 24.13,57.63 v24.13,52.12 24.11,52.12 24.11,50.62 | v21.51,16.59 v27.94,16.61 | 24.11,50.62 23.42,50.62 22.5,51.51 | 24.11,50.62 25.95,50.62 arc-45 26.01,50.6 v26.21,51.84 | v21.39,52.58 22.5,51.51 | v17.17,47.12 17.17,47.27 18.21,48.41 18.92,48.56 20.02,49.51 22,49.51 22.48,49.99 22.48,51.26 | 22.48,51.26 | 22.48,51.26 | 22.48,51.26 22.48,51.28 22.48,51.31 | 22.48,51.31 | 22.48,51.31 | 22.48,51.31 | 22.48,51.31 22.48,51.38 22.48,51.49 22.5,51.51 | v22.68,25.63 v20.73,25.65 | v22.81,38 22.81,43.16 v22.73,43.46